# Altium schematic sheet SH7 - BROADCOM ENCODER.SchDoc: Broadcom Encoder
size B; CheckedBy: Wolfgang Windholtz; Engineer: Sahil Kale; Revision: 1.0; SheetNumber: 7; SheetTotal: 7
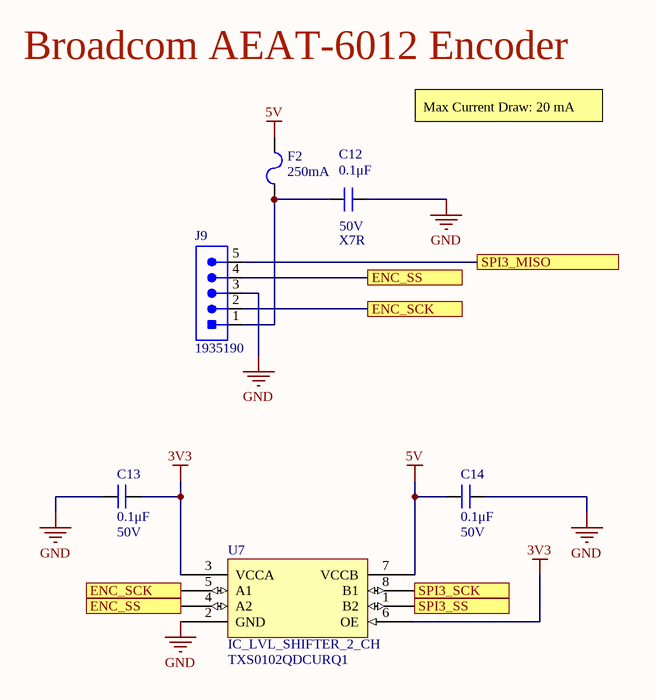
[diagram p0: SH7 - BROADCOM ENCODER.SchDoc]

## Parts
C12  value 0.1μF  Dielectric: X7R  Voltage Rating: 50V  [CAP0603]  (hidden comment: CAP_0.1uF_50V_0603)
C13  value 0.1μF  Voltage Rating: 50V  [CAP2012]  (hidden comment: CAP_0.1uF_50V_0805)
C14  value 0.1μF  Voltage Rating: 50V  [CAP2012]  (hidden comment: CAP_0.1uF_50V_0805)
F2  Current Rating: 250mA  [FUSE_0603]  (hidden comment: FUSE_250mA_0603)
J9  CON_5POS_SCREW_TERM  [1935190]  (value not drawn)
U7  IC_LVL_SHIFTER_2_CH  [TXS0102QDCURQ1]

## Ports
ENC_SCK, ENC_SS, SPI3_MISO, SPI3_SCK, SPI3_SS

## Nets
3V3: C13.2 U7.3(VCCA) U7.6(OE)
5V: C14.1 F2.2 U7.7(VCCB)
GND: C12.1 C13.1 C14.2 J9.3 U7.2(GND)
ENC_SCK: J9.2 U7.5(A1) ; port ENC_SCK
ENC_SS: J9.4 U7.4(A2) ; port ENC_SS
SPI3_MISO: J9.5 ; port SPI3_MISO
SPI3_SCK: U7.8(B1) ; port SPI3_SCK
SPI3_SS: U7.1(B2) ; port SPI3_SS
NetC12_2: C12.2 F2.1 J9.1

## Notes on the sheet
- Broadcom AEAT-6012 Encoder
- Max Current Draw: 20 mA
- Title:
- Project:
- Date:
- Rev:
- Reviewer:
- Engineer:
- Sheet:
- of

## Library data of the parts
C12 = CAP_0.1uF_50V_0603: CAP CER 0.1UF 50V X7R 0603; Manufacturer Part Number 1: CC0603KRX7R9BB104; Manufacturer 1: Yageo; Package/Footprint: 0603; Supplier Part Number 1: 311-1344-1-ND; Supplier 1: Digi-Key; Mounting Type: SMD
C13 C14 = CAP_0.1uF_50V_0805: CAP CER 0.1UF 50V X7R 0805; Manufacturer 1: Murata Electronics; Manufacturer Part Number 1: GCM21BR71H104KA37K; Package/Footprint: 0805; Mounting Type: SMD; Supplier 1: Digi-Key; Supplier Part Number 1: 490-8049-1-ND; Dielectric: X7R; LCSC Part #: C49678
F2 = FUSE_250mA_0603: FUSE SMD 250mA 32V; Manufacturer 1: Littelfuse; Manufacturer Part Number 1: 0467.250NRHF; Package/Footprint: 0603; Voltage Rating (DC): 32V; Supplier 1: Digi-Key; Supplier Part Number 1: F6020CT-ND; Mounting Type: SMD
J9 = CON_5POS_SCREW_TERM: TERM BLK 5POS SIDE ENTRY 5MM; Manufacturer 1: Phoenix Contact; Package/Footprint: TH; Supplier 1: Digi-Key; Mounting Type: TH; Supplier Part Number 1: 277-1580-ND; Manufacturer Part Number 1: 1935190
U7 = IC_LVL_SHIFTER_2_CH: IC TRNSLTR BIDIRECTIONAL US8; Manufacturer 1: Texas Instruments; Package Body Material: Plastic; Interface IC Type: INTERFACE CIRCUIT; Number of Functions: 1; Max Supply Voltage: 4.6V; Min Supply Voltage: -0.5V; Supply Voltage-Nom: 3.3V; Supplier 1: Digi-Key; RoHS: Yes; Category: Interface ICs; Stock 1: 25079; Pricing 1: 1=0.82000, 10=0.71900, 25=0.67600, 100=0.55150, 250=0.51232, 500=0.43600, 1000=0.34880 (USD); Package Code: VSSOP; Number of Pins: 8; Package Shape: Rectangular; Terminal Finish: Nickel; Min Operating Temperature: -40°C; Max Operating Temperature: 125°C; JESD-609 Code: e4; JESD-30 Code: R-PDSO-G8; Moisture Sensitivity Level: 2; Package Style: SMALL OUTLINE, VERY THIN PROFILE, SHRINK PITCHMeter; Peak Reflow Temperature (Cel): 260°C; Surface Mount: Yes; Terminal Form: Gull Wing; Terminal Position: DUAL; Length: 2.3mm; Width: 2mm; Height - Seated (Max): 0.9mm; Terminal Pitch: 0.5mm; Temperature Grade: AUTOMOTIVE; ComponentLink1URL: https://www.ti.com:443/lit/ds/symlink/txs0102-q1.pdf?src-supplier=IHS+Markit; ComponentLink1Description: https://www.ti.com:443/lit/ds/symlink/txs0102-q1.pdf?src-supplier=IHS+Markit; ComponentLink2URL: https://datasheet.ciiva.com/48438/txs0102-q1-48438266.pdf?src-supplier=Avnet; ComponentLink2Description: https://datasheet.ciiva.com/48438/txs0102-q1-48438266.pdf?src-supplier=Avnet; Supplier Part Number 1: 296-37938-1-ND; Manufacturer Part Number 1: TXS0102QDCURQ1